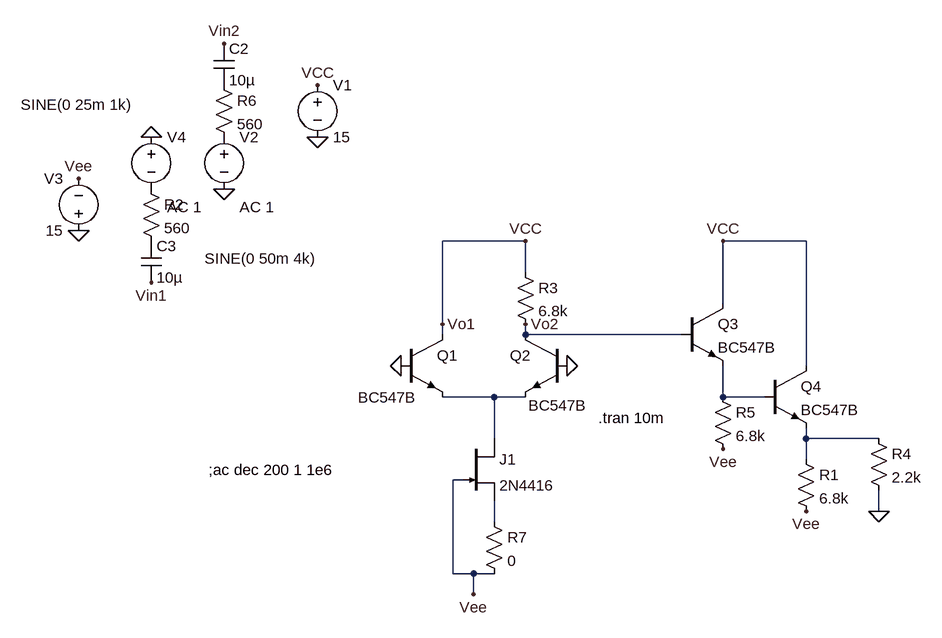
[diagram p0: schematic Draft1.asc]
Draft1.asc, the LTspice schematic file:
Version 4
SHEET 1 964 680
WIRE 352 -32 224 -32
WIRE 784 -32 656 -32
WIRE 352 16 352 -32
WIRE 656 64 656 -32
WIRE 224 96 224 -32
WIRE 224 112 224 96
WIRE 352 112 352 96
WIRE 592 112 352 112
WIRE 784 160 784 -32
WIRE 304 208 224 208
WIRE 352 208 304 208
WIRE 656 208 656 160
WIRE 720 208 656 208
WIRE 304 272 304 208
WIRE 784 272 784 256
WIRE 896 272 784 272
WIRE 784 304 784 272
WIRE 256 336 240 336
WIRE 896 384 896 352
WIRE 304 400 304 368
WIRE 240 480 240 336
WIRE 272 480 240 480
WIRE 304 480 272 480
WIRE 272 512 272 480
FLAG 352 -32 VCC
FLAG 32 -272 VCC
FLAG 32 -192 0
FLAG -112 -112 0
FLAG -336 -128 Vee
FLAG -336 -48 0
FLAG 224 96 Vo1
FLAG 352 96 Vo2
FLAG 896 384 0
FLAG -112 -336 Vin2
FLAG -224 -192 0
FLAG -224 32 Vin1
FLAG 272 512 Vee
FLAG 416 160 0
FLAG 160 160 0
FLAG 656 -32 VCC
FLAG 784 384 Vee
FLAG 656 288 Vee
SYMBOL njf 256 272 R0
SYMATTR InstName J1
SYMATTR Value 2N4416
SYMBOL res 336 0 R0
SYMATTR InstName R3
SYMATTR Value 6.8k
SYMBOL voltage 32 -288 R0
WINDOW 123 0 0 Left 0
WINDOW 39 0 0 Left 0
SYMATTR InstName V1
SYMATTR Value 15
SYMBOL voltage -112 -208 R0
WINDOW 3 -30 203 Left 2
WINDOW 123 24 124 Left 2
WINDOW 39 0 0 Left 0
SYMATTR Value SINE(0 50m 4k)
SYMATTR Value2 AC 1
SYMATTR InstName V2
SYMBOL voltage -336 -32 R180
WINDOW 0 24 96 Left 2
WINDOW 3 24 16 Left 2
WINDOW 123 0 0 Left 0
WINDOW 39 0 0 Left 0
SYMATTR InstName V3
SYMATTR Value 15
SYMBOL voltage -224 -208 R0
WINDOW 3 -201 -34 Left 2
WINDOW 123 24 124 Left 2
WINDOW 39 0 0 Left 0
SYMATTR Value SINE(0 25m 1k)
SYMATTR Value2 AC 1
SYMATTR InstName V4
SYMBOL npn 592 64 R0
SYMATTR InstName Q3
SYMATTR Value BC547B
SYMBOL npn 720 160 R0
SYMATTR InstName Q4
SYMATTR Value BC547B
SYMBOL res 768 288 R0
SYMATTR InstName R1
SYMATTR Value 6.8k
SYMBOL res 880 256 R0
SYMATTR InstName R4
SYMATTR Value 2.2k
SYMBOL npn 160 112 R0
WINDOW 3 -66 97 Left 2
SYMATTR Value BC547B
SYMATTR InstName Q1
SYMBOL res -128 -288 R0
SYMATTR InstName R6
SYMATTR Value 560
SYMBOL res -240 -128 R0
SYMATTR InstName R2
SYMATTR Value 560
SYMBOL cap -240 -32 R0
SYMATTR InstName C3
SYMATTR Value 10µ
SYMBOL res 288 384 R0
SYMATTR InstName R7
SYMATTR Value 0
SYMBOL npn 416 112 M0
WINDOW 3 -30 109 Left 2
SYMATTR Value BC547B
SYMATTR InstName Q2
SYMBOL cap -128 -336 R0
SYMATTR InstName C2
SYMATTR Value 10µ
SYMBOL res 640 192 R0
SYMATTR InstName R5
SYMATTR Value 6.8k
TEXT -136 320 Left 2 !;ac dec 200 1 1e6
TEXT 464 240 Left 2 !.tran 10m

The netlist it stands for:
* Draft1.asc
J1 N001 Vee N004 2N4416
R3 Vo1 Vo2 6.8k
V1 Vo1 0 15
V2 P001 0 SINE(0 50m 4k) AC 1
V3 0 Vee 15
V4 0 P002 SINE(0 25m 1k) AC 1
Q3 Vo1 Vo2 N002 0 BC547B
Q4 Vo1 N002 N003 0 BC547B
R1 N003 Vee 6.8k
R4 N003 0 2.2k
Q1 Vo1 0 N001 0 BC547B
R6 P003 P001 560
R2 P002 P004 560
C3 P004 Vin1 10µ
R7 N004 Vee 0
Q2 Vo2 0 N001 0 BC547B
C2 Vin2 P003 10µ
R5 N002 Vee 6.8k
.model NPN NPN
.model PNP PNP
.lib standard.bjt
.model NJF NJF
.model PJF PJF
.lib standard.jft
;ac dec 200 1 1e6
.tran 10m
.backanno
.end